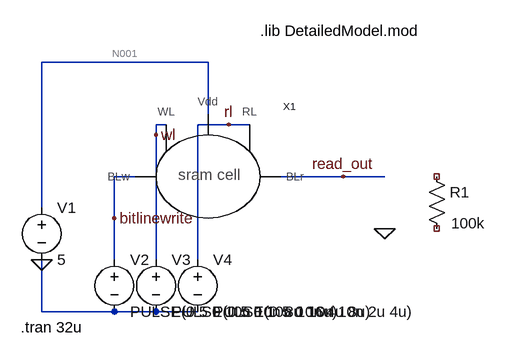
[diagram p0: schematic sram_test.asc]
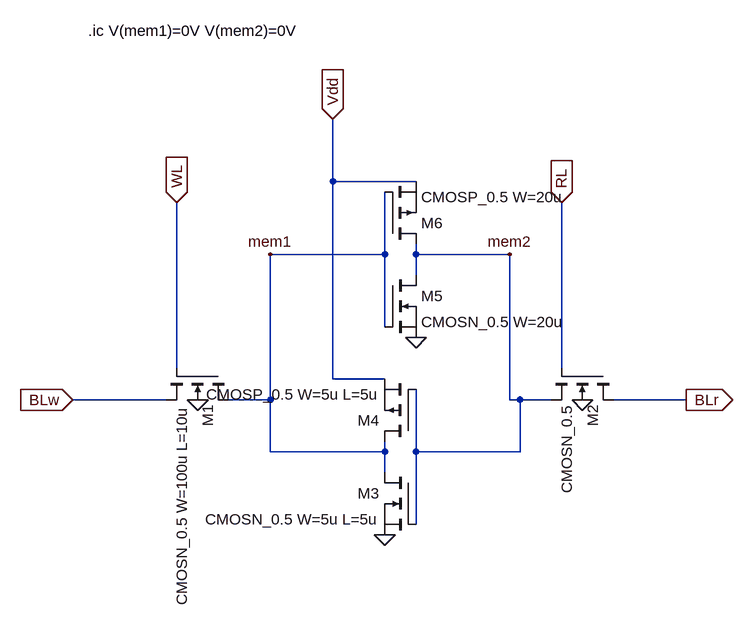
[diagram p1: sub-circuit s_sram_cell.asc]
* sram_test.asc
XX1 N001 wl rl bitlinewrite read_out s_sram_cell
V1 N001 0 5
R1 NC_01 NC_02 100k
V2 bitlinewrite 0 PULSE(0 5 0 10n 10n 8u 16u)
V3 wl 0 PULSE(0 5 0 10n 10n 4u 8u)
V4 rl 0 PULSE(0 5 0 10n 10n 2u 4u)

* block symbol definitions
.subckt s_sram_cell Vdd WL RL BLw BLr
M1 mem1 WL BLw 0 CMOSN_0.5 W=100u L=10u
M2 BLr RL mem2 0 CMOSN_0.5
M3 mem1 mem2 0 0 CMOSN_0.5 W=5u L=5u
M4 mem1 mem2 Vdd Vdd CMOSP_0.5 W=5u L=5u
M5 mem2 mem1 0 0 CMOSN_0.5 W=20u
M6 mem2 mem1 Vdd Vdd CMOSP_0.5 W=20u
.ic V(mem1)=0V V(mem2)=0V
.ends s_sram_cell

.model NMOS NMOS
.model PMOS PMOS
.lib standard.mos
.tran 32u
.lib DetailedModel.mod
.backanno
.end

* Results of the author's LTspice run, read from the files saved beside the schematic
* Operating Point, zero values left out:
*   V(n001) = 5 V
*   I(V1) = -821.4 µA
*   Ix(x1:VDD) = 821.4 µA
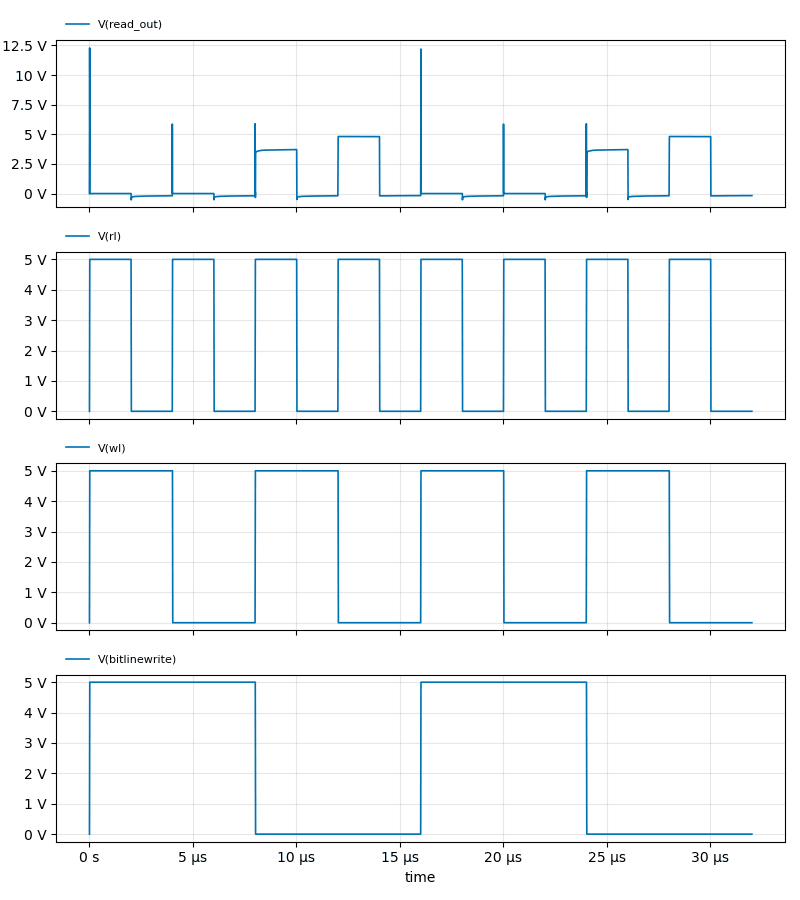
[diagram p2: Transient Analysis of sram_test.asc, plotted from the saved traces]
* Transient Analysis, 1 run:
*   V(read_out): min -533.1 mV, max 12.29 V, average 962.9 mV, rms 2.148 V, last -172.1 mV
*   V(rl): min 0 V, max 5 V, average 2.512 V, rms 3.541 V, last 0 V
*   V(wl): min 0 V, max 5 V, average 2.506 V, rms 3.538 V, last 0 V
*   V(bitlinewrite): min 0 V, max 5 V, average 2.503 V, rms 3.537 V, last 0 V